# EasyEDA Pro project ProPrj_VFD-CLOCK_2024-10-19.epro, board PCB1
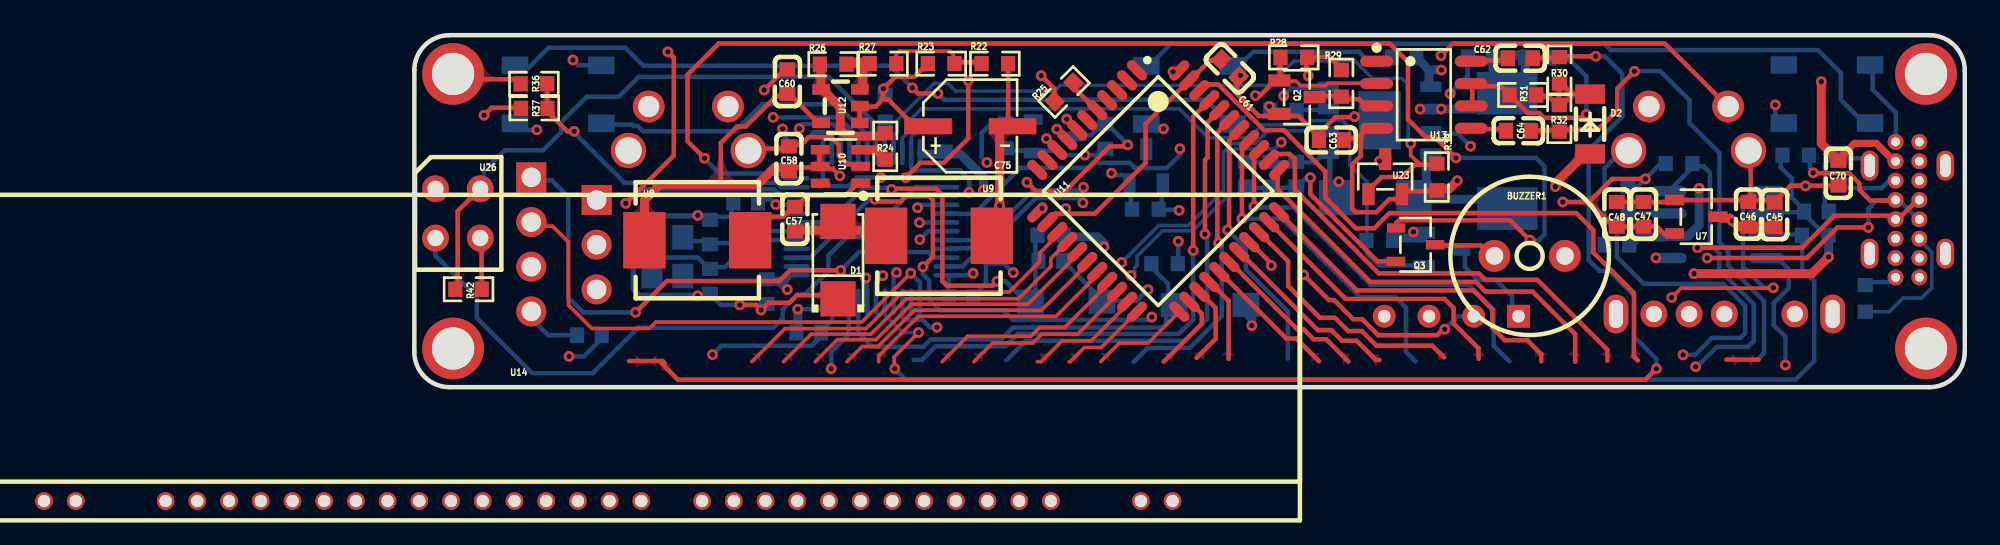
[diagram p6: board, top side]
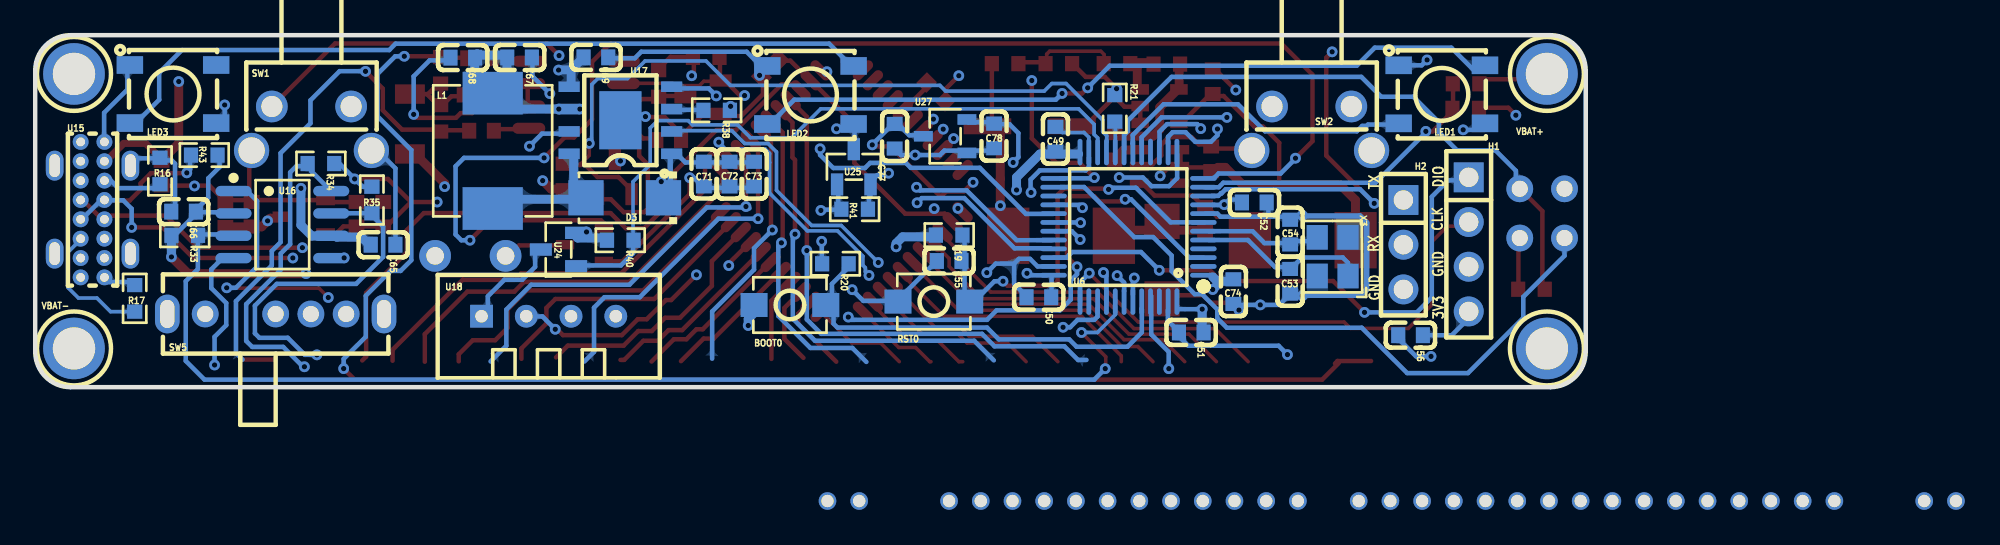
[diagram p7: board, bottom side, seen from below]

Outline 88 x 20 mm; copper layers: Top Layer, Inner1, Inner2, Bottom Layer. Coordinates in mm from the lower left corner of the outline.
Outline path: 0,18 0,2 arc(0.59,0.59) 2,0 86,0 arc(87.41,0.59) 88,2 88,18 arc(87.41,19.41) 86,20 2,20 arc(0.59,19.41) 0,18
Stack: Top Layer 0.035mm 外层铜厚1oz / Dielectric1 0.2104mm 7628 RC49% 8.6mil / Inner1 0.0152mm 内层铜厚 / Dielectric2 1.065mm 1.1mm H/HOZ 含铜 / Inner2 0.0152mm 内层铜厚 / Dielectric3 0.2104mm 7628 RC49% 8.6mil / Bottom Layer 0.035mm 外层铜厚1oz

## Design rules (mm)
template: 自定义配置
spacing copperThickness1oz (default): track to track 0.102, other pairs 0.152 to 0.3
spacing copperThickness2oz: track to track 0.203, other pairs 0.152 to 0.3
track width copperThickness1oz (default): min 0.127, default 0.254, max 2.54
track width copperThickness2oz: min 0.203, default 0.254, max 2.54
differential pair differentialPair (default): width min 0.127, default 0.254, max 2.54; gap min 0.152, default 0.152
via viaSize (default): diameter min 0.5, default 0.61, max 10; hole min 0.3, default 0.305, max 6.3

## Placement (name value [footprint] x y rotation side)
BOOT0  K2-1807SN-A3DW-06  [Key_SMD_3x4x2]  45.16 4.67 0 bottom
BUZZER1  HX-9042  [BUZ-TH_BD9.0-P4.00-D0.6-FD]  63.3 7.46 180 top
C45  100nF  [C0603]  77.21 9.8 270 top
C46  10uF  [C0603]  75.72 9.83 270 top
C47  22uF  [C0603]  69.76 9.83 270 top
C48  10uF  [C0603]  68.25 9.83 270 top
C49  100nF  [C0603]  30.1 14.09 270 bottom
C50  100nF  [C0603]  31.04 5.11 180 bottom
C51  100nF  [C0603]  22.38 3.11 180 bottom
C52  100nF  [C0603]  18.81 10.49 0 bottom
C53  20pF  [C0603]  16.78 6.02 270 bottom
C54  20pF  [C0603]  16.78 8.81 90 bottom
C55  100nF  [C0603]  36.13 7.17 180 bottom
C56  100nF  [C0603]  9.94 2.95 180 bottom
C57  1uF  [C0603]  21.6 9.55 90 top
C58  100nF  [C0603]  21.26 12.98 270 top
C60  100nF  [C0603]  21.17 17.36 270 top
C61  100nF  [C0603]  46.29 18.13 135 top
C62  10uF  [C0603]  62.78 18.69 0 top
C63  100nF  [C0603]  52.05 14.04 0 top
C64  10uF  [C0603]  62.67 14.57 0 top
C65  10uF  [C0603]  68.26 8.09 0 bottom
C66  100nF  [C0603]  79.58 9.97 0 bottom
C67  100nF  [C0603]  60.51 18.73 0 bottom
C68  22uF  [C0603]  63.73 18.72 180 bottom
C69  100nF  [C0603]  56.18 18.74 0 bottom
C70  22uF  [C0603]  80.83 12.16 90 top
C71  100nF  [C0603]  50.05 12.11 270 bottom
C72  22uF  [C0603]  48.59 12.11 270 bottom
C73  22uF  [C0603]  47.2 12.11 270 bottom
C74  100nF  [C0603]  20 5.43 270 bottom
C75  47uF  [C_Ele_SMD_5x5.4mm]  31.55 14.83 0 top
C77  10uF  [C0603]  39.22 14.26 90 bottom
C78  22uF  [C0603]  33.58 14.28 90 bottom
D1  SS34  [SMA_L4.3-W2.6-LS5.2-RD]  24.04 7.22 90 top
D2  ZMM5V1-M  [LL-34_L3.5-W1.5-RD]  66.73 14.95 270 top
D3  SS34  [SMA_L4.3-W2.6-LS5.2-RD]  54.54 10.76 0 bottom
H1  -  [HDR-TH_4P-P2.54-V-M]  6.64 8.11 270 bottom
H2  PZ254V-11-03P  [HDR-TH_3P-P2.54-V-M]  10.34 8.09 270 bottom
L1  10uH  [IND-SMD_L7.3-W6.6]  62.03 13.43 90 bottom
LED1  WS2812B-5050RGB  [LED-SMD_4P-L5.0-W5.0-BR_WS2812B-5050RGB]  8.16 16.64 0 bottom
LED2  WS2812B-5050RGB  [LED-SMD_4P-L5.0-W5.0-BR_WS2812B-5050RGB]  44 16.6 0 bottom
LED3  WS2812B-5050RGB  [LED-SMD_4P-L5.0-W5.0-BR_WS2812B-5050RGB]  80.18 16.66 0 bottom
Q2  SI2302  [SOT-23-3_L2.9-W1.3-P1.90-LS2.4-BR]  50.1 16.48 180 top
Q3  S8050 J3Y  [SOT-23-3_L3.0-W1.7-P0.95-LS2.9-BR]  56.83 8.09 180 top
R16  5.1kΩ  [R0603]  80.92 12.29 270 bottom
R17  5.1kΩ  [R0603]  82.35 5.05 270 bottom
R19  4.7kΩ  [R0603]  36.13 8.64 0 bottom
R20  4.7kΩ  [R0603]  42.59 7.01 180 bottom
R21  4.7kΩ  [R0603]  26.73 15.84 270 bottom
R22  75kΩ  [r0603]  32.95 18.38 0 top
R23  2kΩ  [r0603]  29.9 18.38 0 top
R24  100kΩ  [r0603]  26.73 13.68 270 top
R25  100kΩ  [r0603]  36.88 16.77 45 top
R26  100kΩ  [r0603]  23.77 18.36 0 top
R27  100kΩ  [r0603]  26.6 18.38 0 top
R28  10kΩ  [R0603]  49.92 18.74 0 top
R29  10kΩ  [R0603]  52.61 17.26 90 top
R30  3kΩ  [r0603]  64.99 18 90 top
R31  20kΩ  [r0603]  62.92 16.6 0 top
R32  3kΩ  [r0603]  64.99 15.28 90 top
R33  4.7kΩ  [R0603]  79.51 8.63 180 bottom
R34  4.7kΩ  [R0603]  71.78 12.71 180 bottom
R35  4.7kΩ  [R0603]  68.89 10.64 90 bottom
R36  2.7kΩ  [R0603]  6.79 17.24 180 top
R37  10kΩ  [R0603]  6.81 15.84 0 top
R38  1.1kΩ  [R0603]  49.32 15.73 0 bottom
R39  4.7kΩ  [R0603]  58.03 11.94 270 top
R40  4.7kΩ  [R0603]  54.79 8.35 0 bottom
R41  4.7kΩ  [R0603]  41.49 10.11 180 bottom
R42  100kΩ  [R0603]  3.08 5.56 0 top
R43  1.5kΩ  [R0603]  78.41 13.19 0 bottom
RST0  K2-1807SN-A3DW-06  [Key_SMD_3x4x2]  37 4.86 180 bottom
SW1  TS-1038-A10B3-D2  [KEY-TH_TS-1038-A10B3-D2]  72.32 14.7 0 bottom
SW2  TS-1038-A10B3-D2  [KEY-TH_TS-1038-A10B3-D2]  15.55 14.7 0 bottom
SW5  SK13D07VG4  [SW-TH_SK13D07VG4]  74.35 4.16 180 bottom
U6  -  [LQFP-48_L7.0-W7.0-P0.50-LS9.0-BL]  25.95 9.11 90 bottom
U7  ME6206A33XG  [SOT-23-3_L2.9-W1.6-P1.90-LS2.8-BR]  72.76 9.69 180 top
U8  10uH  [IND-SMD_L7.0-W6.6]  16.06 8.35 0 top
U9  10uH  [IND-SMD_L7.0-W6.6]  29.78 8.6 0 top
U10  MT3608  [SOT-23-6_L2.9-W1.6-P0.95-LS2.8-BL]  24.19 12.54 90 top
U11  PT6315-LQ  [LQFP-PT6315]  42.22 11.14 315 top
U12  LM321MF  [SOT-23-5_L2.9-W1.6-P0.95-LS2.8-BR]  24.19 15.97 0 top
U13  TC118S  [SOP-8_L4.9-W3.9-P1.27-LS6.0-BL]  57.3 16.62 270 top
U14  -  [7-BT-317NK]  5.14 0.35 0 top
U15  MC-118LD-H65  [USB-C-TH_HANBO_MC-118LD-H65]  84.75 10.09 90 bottom
U16  DS3231MZ/V+  [SOIC-8_L4.9-W3.9-P1.27-LS6.0-BL]  73.97 9.24 270 bottom
U17  TP5400  [ESOP-8_L4.9-W3.9-P1.27-LS6.0-BL-EP]  54.79 15.17 90 bottom
U18  DHT11  [SENSOR-TH_DHT11]  58.86 4.03 180 bottom
U21  M2*10+3六角单通铜  [CONN-TH_C9900012092]  2.2 2.2 180 bottom
U22  M2*10+3六角单通铜  [CONN-TH_C9900012092]  85.8 17.8 180 bottom
U23  AO3401  [SOT-23-3_L2.9-W1.3-P0.95-LS2.4-BR]  55.1 11.97 270 top
U24  AO3401  [SOT-23-3_L2.9-W1.3-P0.95-LS2.4-BR]  58.3 7.82 180 bottom
U25  AO3401  [SOT-23-3_L2.9-W1.3-P0.95-LS2.4-BR]  41.54 12.52 270 bottom
U26  ITR20001/T  [OPTO-TH_4P_ITR20001-T-F316]  2.47 9.87 90 top
U27  ME6206A33XG  [SOT-23-3_L2.9-W1.6-P1.90-LS2.8-BR]  36.35 14.26 180 bottom
VBAT+  M2*10+3六角单通铜  [CONN-TH_C9900012092]  2.2 17.8 180 bottom
VBAT-  M2*10+3六角单通铜  [CONN-TH_C9900012092]  85.8 2.2 180 bottom
X3  8MHz  [OSC-SMD_4P-L3.2-W2.5-BL]  14.36 7.41 90 bottom

## Footprints (pads in the part's own frame, mm; a bottom-side part is the same pattern mirrored in y, then rotated)
7-BT-317NK
  round 1 hole 0.7: 1(-26.154,-6.817) 2(-24.355,-6.817) 3(-19.255,-6.817) 4(-17.454,-6.817) 5(-15.655,-6.817) 6(-13.854,-6.817) 7(-12.055,-6.817) 8(-10.255,-6.817) 9(-8.454,-6.817) 10(-6.654,-6.817) 11(-4.854,-6.817) 12(-3.054,-6.817) 13(-1.254,-6.817) 14(0.545,-6.817) 15(2.345,-6.817) 16(4.146,-6.817) 17(5.946,-6.817) 18(7.745,-6.817) 19(11.195,-6.817) 20(12.995,-6.817) 21(14.796,-6.817) 22(16.596,-6.817) 23(18.395,-6.817) 24(20.195,-6.817) 25(21.995,-6.817) 26(23.796,-6.817) 27(25.596,-6.817) 28(27.395,-6.817) 29(29.195,-6.817) 30(30.995,-6.817) 31(36.096,-6.817) 32(37.895,-6.817)
BUZ-TH_BD9.0-P4.00-D0.6-FD
  round 1.8 hole 1: 1(-2,0) 2(2,0)
C0603
  rect 0.8x0.9 smd: 1(-0.7,0) 2(0.7,0)
C_Ele_SMD_5x5.4mm
  rect 2.7x0.91 smd: 1(-2.4,0) 2(2.4,0)
CONN-TH_C9900012092
  round 3.5 hole 2.4: 1(0,0)
ESOP-8_L4.9-W3.9-P1.27-LS6.0-BL-EP
  rect 0.6x1.2 smd: 1(-1.905,-2.909) 2(-0.635,-2.909) 3(0.635,-2.909) 4(1.905,-2.909) 5(1.905,2.909) 6(0.635,2.909) 7(-0.635,2.909) 8(-1.905,2.909)
  rect 3.3x2.4 smd: 9(0,0)
HDR-TH_3P-P2.54-V-M
  rect 1.7x1.7 hole 1.1: 1(-2.54,0)
  round 1.7 hole 1.1: 2(0,0) 3(2.54,0)
HDR-TH_4P-P2.54-V-M
  rect 1.7x1.7 hole 1.1: 1(-3.81,0)
  round 1.7 hole 1.1: 2(-1.27,0) 3(1.27,0) 4(3.81,0)
IND-SMD_L7.0-W6.6
  rect 2.4x3.2 smd: 1(-3,0) 2(3,0)
IND-SMD_L7.3-W6.6
  rect 2.424x3.42 smd: 1(3.278,0) 2(-3.278,0)
KEY-TH_TS-1038-A10B3-D2
  round 1.8 hole 1.2: 1(-2.25,-1.25) 2(2.25,-1.25)
  round 2 hole 1.5: 3(-3.4,1.25) 3(3.4,1.25)
Key_SMD_3x4x2
  rect 1.53x1.36 smd: 1(-2.035,0) 2(2.035,0)
LED-SMD_4P-L5.0-W5.0-BR_WS2812B-5050RGB
  rect 1.5x1 smd: 1(2.45,-1.65) 2(2.45,1.65) 3(-2.45,1.65) 4(-2.45,-1.65)
LL-34_L3.5-W1.5-RD
  rect 1.1x1.7 smd: 1(-1.7,0) 2(1.7,0)
LQFP-48_L7.0-W7.0-P0.50-LS9.0-BL
  oval 0.27x1.5 smd: 1(-2.75,-4.25) 2(-2.25,-4.25) 3(-1.75,-4.25) 4(-1.25,-4.25) 5(-0.75,-4.25) 6(-0.25,-4.25) 7(0.25,-4.25) 8(0.75,-4.25) 9(1.25,-4.25) 10(1.75,-4.25) 11(2.25,-4.25) 12(2.75,-4.25) 25(2.75,4.25) 26(2.25,4.25) 27(1.75,4.25) 28(1.25,4.25) 29(0.75,4.25) 30(0.25,4.25) 31(-0.25,4.25) 32(-0.75,4.25) 33(-1.25,4.25) 34(-1.75,4.25) 35(-2.25,4.25) 36(-2.75,4.25)
  oval 1.5x0.27 smd: 13(4.25,-2.75) 14(4.25,-2.25) 15(4.25,-1.75) 16(4.25,-1.25) 17(4.25,-0.75) 18(4.25,-0.25) 19(4.25,0.25) 20(4.25,0.75) 21(4.25,1.25) 22(4.25,1.75) 23(4.25,2.25) 24(4.25,2.75) 37(-4.25,2.75) 38(-4.25,2.25) 39(-4.25,1.75) 40(-4.25,1.25) 41(-4.25,0.75) 42(-4.25,0.25) 43(-4.25,-0.25) 44(-4.25,-0.75) 45(-4.25,-1.25) 46(-4.25,-1.75) 47(-4.25,-2.25) 48(-4.25,-2.75)
LQFP-PT6315
  oval 1.4x0.55 smd: 1(-5.7,4) 2(-5.7,3.2) 3(-5.7,2.4) 4(-5.7,1.6) 5(-5.7,0.8) 6(-5.7,0) 7(-5.7,-0.8) 8(-5.7,-1.6) 9(-5.7,-2.4) 10(-5.7,-3.2) 11(-5.7,-4) 23(5.7,-4) 24(5.7,-3.2) 25(5.7,-2.4) 26(5.7,-1.6) 27(5.7,-0.8) 28(5.7,0) 29(5.7,0.8) 30(5.7,1.6) 31(5.7,2.4) 32(5.7,3.2) 33(5.7,4)
  oval 0.55x1.4 smd: 12(-4,-5.7) 13(-3.2,-5.7) 14(-2.4,-5.7) 15(-1.6,-5.7) 16(-0.8,-5.7) 17(0,-5.7) 18(0.8,-5.7) 19(1.6,-5.7) 20(2.4,-5.7) 21(3.2,-5.7) 22(4,-5.7) 34(4,5.7) 35(3.2,5.7) 36(2.4,5.7) 37(1.6,5.7) 38(0.8,5.7) 39(0,5.7) 40(-0.8,5.7) 41(-1.6,5.7) 42(-2.4,5.7) 43(-3.2,5.7) 44(-4,5.7)
OPTO-TH_4P_ITR20001-T-F316
  round 1.524 hole 0.914: 1(-1.4,-1.27) 2(-1.4,1.27) 3(1.4,1.27) 4(1.4,-1.27)
OSC-SMD_4P-L3.2-W2.5-BL
  rect 1.4x1.2 smd: 1(-1.1,-0.875) 2(1.1,-0.875) 3(1.1,0.875) 4(-1.1,0.875)
r0603
  rect 0.806x0.864 smd: 1(-0.753,0) 2(0.753,0)
R0603
  rect 0.806x0.864 smd: 1(-0.753,0) 2(0.753,0)
SENSOR-TH_DHT11
  rect 1.296x1.296 hole 0.711: 1(-3.81,0)
  round 1.296 hole 0.711: 2(-1.27,0) 3(1.27,0) 4(3.81,0)
SMA_L4.3-W2.6-LS5.2-RD
  rect 2x2 smd: 1(-2.2,0) 2(2.2,0)
SOIC-8_L4.9-W3.9-P1.27-LS6.0-BL
  oval 0.588x2.045 smd: 1(-1.905,-2.772) 2(-0.635,-2.772) 3(0.635,-2.772) 4(1.905,-2.772) 5(1.905,2.772) 6(0.635,2.772) 7(-0.635,2.772) 8(-1.905,2.772)
SOP-8_L4.9-W3.9-P1.27-LS6.0-BL
  oval 0.63x1.865 smd: 1(-1.905,-2.683) 2(-0.635,-2.683) 3(0.635,-2.683) 4(1.905,-2.683) 5(1.905,2.683) 6(0.635,2.683) 7(-0.635,2.683) 8(-1.905,2.683)
SOT-23-3_L2.9-W1.3-P0.95-LS2.4-BR
  rect 1.25x0.7 smd: 1(1,-0.95) 2(1,0.95) 3(-1,0)
SOT-23-3_L2.9-W1.3-P1.90-LS2.4-BR
  rect 1.25x0.7 smd: 1(1,-0.95) 2(1,0.95) 3(-1,0)
SOT-23-3_L2.9-W1.6-P1.90-LS2.8-BR
  rect 1.07x0.6 smd: 1(1.235,-0.95) 2(1.235,0.95) 3(-1.235,0)
SOT-23-3_L3.0-W1.7-P0.95-LS2.9-BR
  rect 1.038x0.532 smd: 1(1.101,-0.95) 2(1.101,0.95) 3(-1.101,0)
SOT-23-5_L2.9-W1.6-P0.95-LS2.8-BR
  rect 1x0.6 smd: 1(1.1,-0.95) 2(1.1,0) 3(1.1,0.95) 4(-1.1,0.95) 5(-1.1,-0.95)
SOT-23-6_L2.9-W1.6-P0.95-LS2.8-BL
  rect 0.532x1.072 smd: 1(-0.95,-1.149) 2(0,-1.149) 3(0.95,-1.149) 4(0.95,1.149) 5(0,1.149) 6(-0.95,1.149)
SW-TH_SK13D07VG4
  round 1.524 hole 0.914: 1(-4,0) 3(0,0) 4(2,0) 5(4,0)
  oval 1.4x2.2 hole 0.8x1.6: 6(6.15,0) 7(-6.15,0)
USB-C-TH_HANBO_MC-118LD-H65
  oval 1.7x1 hole 1.3x0.6: 13(-2.5,-2.15) 13(-2.5,2.15) 13(2.5,-2.15) 13(2.5,2.15)
  round 0.9 hole 0.5: A1(-3.85,0.675) A4(-2.75,0.675) A5(-1.65,0.675) A6(-0.55,0.675) A7(0.55,0.675) A8(1.65,0.675) A9(2.75,0.675) A12(3.85,0.675) B1(3.85,-0.675) B4(2.75,-0.675) B5(1.65,-0.675) B6(0.55,-0.675) B7(-0.55,-0.675) B8(-1.65,-0.675) B9(-2.75,-0.675) B12(-3.85,-0.675)

## Nets
As in the schematic.

Pads without a net: LED3 4; U6 2 4 16 27 38 46; U10 6; U11 1 2 3 4 6 10 11; U13 1; U15 A8 B8; U18 3; U21 1

## Via types
v1: diameter 0.61, hole 0.305, Top Layer to Bottom Layer, 127 vias

## Routing (per net, layer and track width the routed paths; a pad name or vN(x,y) marks a point on that pad's centre or on a via; arc(x,y) is an arc through that point)
3V3: length 138
  Top Layer w0.254: v1(65.19,10.52) 66.67,10.52 ; 66.67,10.52 68.11,9.09 ; 66.67,10.52 67.98,11.83 v1(69.87,11.83) ; 68.23,9.17 68.27,9.13 70.51,9.13 70.96,8.69 71.44,8.69
  Top Layer w0.508: v1(80.27,7.4) 79.32,6.45 v1(72.63,6.45)
  Inner2 w0.508: 32.56,9.18 33.8,7.94 39.1,7.94 v1(39.14,7.97) 39.2,7.92 40.75,7.92 45.16,3.5 v1(47.53,3.5) 47.54,3.51 51.06,3.51 53.17,5.62 57.4,5.62 61.41,9.63 65.2,9.63 ; 32.56,9.18 32.54,9.18 31.44,8.08 31.44,7.75 ; 32.56,9.18 32.3,9.43 v1(32.3,11.2) ; 65.2,9.63 65.2,7.61 ; 65.2,9.63 65.2,10.5 v1(65.19,10.52) ; 22.39,5.06 21.91,5.55 v1(21.17,5.55) 20.6,6.12 15.43,6.12 12.25,2.94 7.96,2.94 6.67,4.23 ; 22.39,5.06 v1(21.77,4.43) ; 22.39,5.06 23.18,5.85 23.18,7.75 ; 23.18,7.75 22.03,7.75 20.51,9.26 v1(20.51,10.37) ; 23.18,7.75 23.36,7.57 31.26,7.57 31.44,7.75 ; v1(72.63,6.45) 66.03,6.45 65.21,7.27 ; v1(31.71,6.47) 31.71,7.47 31.44,7.75
  Bottom Layer w0.254: 6.62,3.93 7.6,2.95 9.17,2.95 ; 78.98,9.74 80.13,8.59 80.29,8.59 ; 78.82,10.17 78.78,10.17 78.18,10.77 78.18,11.86 77.54,12.5 77.54,13.18 ; 21.2,10.35 20.54,10.35 v1(20.51,10.37) 20.22,10.66 19.64,10.66 ; 30.61,6.36 31.6,6.36 v1(31.71,6.47) ; 78.81,9.94 76.88,9.94 76.83,9.89 ; 68.9,11.39 69.42,11.39 70.78,12.75 ; 23.18,4.38 23.12,4.43 v1(21.77,4.43) ; 30.32,6.34 30.32,5.13
  Bottom Layer w0.508: v1(32.3,11.2) 32.3,11.92 30.98,13.25 28.78,13.25 ; v1(39.14,7.97) 39.14,8.17 38.77,8.54 36.92,8.54 ; 20.12,6.01 20.7,6.01 ; 20.7,6.01 v1(21.17,5.55) ; 20.7,6.01 20.91,6.01 21.16,6.26 ; 21.66,3.26 21.77,3.36 v1(21.77,4.43) ; 47.01,4.4 47.53,3.88 v1(47.53,3.5) ; v1(80.27,7.4) 80.27,8.52
5V: length 113.4
  Top Layer w0.254: 52.72,14.14 53.5,14.14 54.03,14.66 ; 3.73,8.34 3.82,8.25 3.82,5.75 ; 56.05,10.67 55.33,10.67 54.6,9.94 53.43,9.94 53.23,10.15 53.23,12.65 53.72,13.14 53.72,14.31 54.03,14.66 ; 54.03,14.66 54.1,14.73 ; 56.33,11.14 58.16,11.14
  Top Layer w0.508: v1(59.2,11.73) 58.72,11.25 58.16,11.25 ; 74.17,9.6 74.66,9.6 v1(74.81,9.45) 75.15,9.11 77.2,9.11
  Inner2 w0.508: 72.22,4.2 74.18,4.2 ; 3.88,8.82 5.17,10.11 5.17,13.03 5.62,13.48 9.97,13.48 11.84,11.61 19.31,11.61 19.81,12.11 23,12.11 24.8,13.92 34.49,13.92 36.26,12.15 48.23,12.15 51.07,9.31 56.22,9.31 v1(56.71,8.82) 56.71,9.25 v1(59.2,11.73) 60.89,13.43 65.4,13.43 69.5,9.33 74.69,9.33 v1(74.81,9.45) 74.81,4.71 74.24,4.14
  Bottom Layer w0.254: 39.58,12.05 40.19,12.05 40.6,11.64 ; 40.61,11.73 40.61,10.86 40.68,10.8 40.68,10.14
  Bottom Layer w0.508: 55.7,8.48 57.21,8.48 57.49,8.76 ; v1(56.71,8.82) 56.64,8.75 56.64,8.6
  vias: v1(39.56,12.16)
GND: length 165.7
  Top Layer w0.254: 77.37,10.71 78.11,11.45 80.94,11.45 ; 18.47,4.64 v1(18.47,4.68) 19.38,4.68 v1(19.68,4.38) 20.09,4.8 21.28,4.8 21.71,5.22 23.78,5.22 ; 25.24,14.98 25.28,15.02 25.28,15.94 26.18,15.94 26.59,16.35 26.59,16.93 v1(26.62,16.96) 27.29,17.63 28.38,17.63 29,18.25 ; 62.03,16.72 61.65,17.1 60.47,17.1 ; 60.08,15.94 60.05,15.97 60.05,17.36 ; 71.35,10.63 77.08,10.63 77.21,10.5 ; 55.65,7.15 54.67,7.15 50.86,10.97 v1(50.86,11.9) ; 51.16,14.01 51.16,14.44 50.19,15.41 49.26,15.41 49.21,15.46 ; 28.34,14.9 26.9,16.34 26.64,16.34 ; v1(66.52,15.5) 66.32,15.3 64.12,15.3 63.85,15.57 63.2,15.57 62.43,16.34 ; 19.57,13.56 21.12,13.56 ; 5.96,15.88 4.39,15.88 v1(3.96,15.45) ; 48.75,15.41 47.94,15.41 46.7,16.65 46.7,17.3 ; v1(59.95,13.69) 59.84,13.69 59.8,13.73 ; v1(8.78,1.75) 8.78,1.76 ; 68.21,10.52 71.47,10.52 71.56,10.62 ; 21.15,18.02 20.99,18.02 v1(19.86,16.89) ; 75.82,13.07 75.85,13.04 75.85,10.65 ; 24.98,12.66 24.98,12.67 24.58,12.67 24.09,13.16 24.09,13.78 23.66,14.21 22.37,14.21 21.96,13.79 21.26,13.79 ; v1(35.58,17.7) 36.32,16.96 36.32,16.39 ; 51.32,13.91 51.32,14.39 52.28,15.35 53.34,15.35 v1(53.36,15.37)
  Bottom Layer w0.203: 28.2,13.86 28.2,14.2 28.47,14.47 29.71,14.47 29.88,14.64
  Bottom Layer w0.254: 68.36,13.23 67.55,12.43 67.55,8.31 ; v1(16.93,1.85) 17.43,2.35 22.56,2.35 23.18,2.97 ; 16.83,5.23 17.39,4.68 v1(18.47,4.68) 19.88,4.68 ; v1(38.06,13.19) 36.65,13.19 36.51,13.33 ; 80.83,13.01 82.33,13.01 82.68,12.66 ; 32.44,7.02 32.17,7.29 31.54,7.29 31.11,6.86 30.18,6.86 ; 32.44,7.02 33.48,7.02 v1(33.99,6.51) ; 32.44,7.02 32.44,5.88 31.99,5.42 ; 18.01,10.54 18.01,9.78 18.11,9.69 ; 80.06,10.3 80.06,12.7 80.25,12.89 80.98,12.89 ; 39.17,13.51 38.85,13.19 38.08,13.19 ; 36.51,13.33 36.41,13.44 33.59,13.44 ; v1(9,18.59) 9.31,18.29 10.72,18.29 ; v1(53.36,15.37) 53.48,15.49 54.51,15.49 ; 82.3,5.97 83.79,5.97 83.98,6.17 ; 38.58,5.17 38.58,5.42 36.87,7.13 ; v1(50.86,11.9) 50.62,11.9 50.21,11.5 ; 47.11,11.32 49.94,11.32 50.15,11.54 ; 16.95,9.68 20.73,9.68 20.91,9.87 21.59,9.87 ; 23.29,3.36 23.71,3.78 23.71,4.36 ; v1(41.63,5.54) 41,4.9 39.09,4.9 ; v1(8.78,1.75) 9.63,1.75 10.69,2.81 ; 31.49,11.1 31.5,11.11 31.5,11.8 30.98,12.32 28.38,12.32 28.19,12.5 28.19,13.05 ; 46.88,18.32 47.62,19.06 53.6,19.06 53.97,18.69 55.48,18.69 ; v1(66.52,15.5) 66.52,17.66 65.61,18.57 64.46,18.57 ; v1(59.95,13.69) 59.24,14.41 57.81,14.41 ; 82.77,18.13 82.77,16.91 84.09,15.59 84.09,14.01 ; 43.36,8.26 43.36,6.94 ; v1(58.79,16.68) 59.78,17.67 59.78,18.62
  Bottom Layer w0.305: 16.65,9.73 12.81,9.73 12.43,9.35 12.43,5.55 12.76,5.22 16.51,5.22 16.55,5.26
  vias: v1(16.08,9.76) v1(16.08,5.19) v1(31.48,11.06) v1(35.63,10.16) v1(43.07,17.93) v1(43.36,8.29) v1(46.89,17.72) v1(48.53,15.96) v1(70.47,7.35) v1(78.96,11.43)
VBAT: length 70.1
  Top Layer w0.254: 6.03,17.31 5.85,17.5 3.23,17.5
  Inner2 w0.8: 58.18,15.8 57.15,15.8 54.01,18.95 17.36,18.95 15.94,17.53 3.57,17.53 3.39,17.71 ; 1.9,17.84 2.7,18.64
  Bottom Layer w0.305: 57.61,15.8 58.28,15.8
  Bottom Layer w0.508: 61.23,17.36 61.23,18.86 62.84,18.86 62.92,18.94 63.06,18.8 63.06,17.61 ; v1(57.09,15.8) U17.6 v1(58.28,15.8) 60.9,15.8 61.03,15.93
VBAT_LOW: length 21.8
  Inner2 w0.508: 85.76,17.43 83.14,17.43 77.28,11.57 73.19,11.57 v1(72.92,11.3)
  Bottom Layer w0.508: v1(72.92,11.3) 72.92,9.21 72.3,8.59 70.95,8.59 70.88,8.52 69.47,8.52 69.03,8.08
VBUS: length 65.1
  Top Layer w0.4: 80.79,12.91 81.73,13.85 82.98,13.85 83.91,12.91
  Top Layer w0.503: v1(79.85,17.37) 79.85,13.85 80.79,12.91
  Inner2 w0.305: 83.96,12.87 83.01,13.82 82.17,13.82 81.68,13.33 81.68,6.65 82.06,6.27 82.99,6.27 83.87,7.15
  Inner2 w0.503: v1(79.85,17.37) 78.46,18.77 68.44,18.77 67.69,18.02 v1(58.3,18.02)
  Inner2 w0.508: 85.42,12.87 85.38,12.83 84.06,12.83 ; 85.51,7.3 85.42,7.38 84.09,7.38 ; 82.99,6.27 82.99,3.56 82.09,2.65 71.59,2.65 70.4,3.84
  Bottom Layer w0.503: 56.84,18.77 57.59,18.03 ; 57.59,18.03 57.59,17.12 ; 57.59,18.03 58.28,18.03 v1(58.3,18.02)
32K: length 73
  Top Layer w0.203: v1(77.13,5.65) 77.11,5.63 71.9,5.63 v1(71.37,5.09)
  Top Layer w0.254: v1(26.14,10.68) 26.26,10.56 27.6,10.56 27.89,10.85 29.21,10.85 29.44,10.63 29.44,7.41 v1(28.87,6.84)
  Inner2 w0.203: v1(41.85,3.98) 43.02,2.81 55.45,2.81 56.33,3.69 56.33,4.48 56.81,4.96 66.5,4.96 66.51,4.95 67.13,5.57 70.89,5.57 v1(71.37,5.09)
  Bottom Layer w0.254: 75.87,11.04 75.41,10.58 75.41,6.84 76.61,5.65 v1(77.13,5.65) ; 21.68,7.36 22.48,7.36 25.81,10.68 v1(26.14,10.68) ; v1(28.87,6.84) 28.87,6.42 29.23,6.06 29.23,4.98 29.84,4.36 33.44,4.36 33.98,3.83 41.69,3.83 v1(41.85,3.98)
B1: length 81.9
  Top Layer w0.254: v1(58.27,18.84) 58.96,19.53 70.98,19.53 74.46,16.04 ; 12,10.44 14.72,13.16 14.72,18.72 v1(14.39,19.06)
  Inner2 w0.254: v1(14.39,19.06) 14.91,19.57 55.24,19.57 55.97,18.84 v1(58.27,18.84)
  Bottom Layer w0.254: v1(12,10.44) 12.81,11.25 20.43,11.25 20.67,11.01 20.69,11.03 20.85,10.87 21.24,10.87
B2: length 24.4
  Top Layer w0.254: v1(31.44,17.42) 31.44,14.14 30.05,12.75 28.73,12.75 v1(27.89,11.91)
  Inner2 w0.254: 31.39,17.32 31.39,17.48 31.07,17.8 19.72,17.8 17.78,15.86
  Bottom Layer w0.254: v1(27.89,11.91) 27.93,11.87 29.84,11.87
BAT-5V: length 41.4
  Inner2 w0.508: v1(52.47,11.68) 56.64,11.68 59.5,14.54 65.52,14.54 69.77,10.3 76.08,10.3 78.29,8.09 78.29,4.1
  Bottom Layer w0.254: 47.3,12.77 51.1,12.77 51.47,13.14
  Bottom Layer w0.305: 51.96,13.14 51.96,10.83 51.77,10.64
  Bottom Layer w0.508: v1(52.47,11.68) 52.47,11.33 52.79,11.01
BAT_CHRG: length 32.1
  Inner2 w0.254: v1(27.37,6.51) 27.37,6.26 28.48,5.15 36.96,5.15 38.89,7.08 v1(40.15,7.08)
  Bottom Layer w0.203: 51.88,14.58 48.46,14.58 47.73,13.84 46.41,13.84 45.93,13.37 45.93,11.19 43.93,9.19 42.25,9.19 v1(40.15,7.08)
  Bottom Layer w0.254: v1(27.37,6.51) 27.2,6.35 27.2,4.88
BAT_FULL: length 33.8
  Inner2 w0.254: 49.37,16.53 49.96,15.94 49.96,14.68 v1(49.2,13.92) ; v1(40.68,6.35) 37.73,3.4 v1(29.66,3.4)
  Bottom Layer w0.203: 46.32,12.76 46.32,13.29 46.57,13.54 48.83,13.54 49.19,13.9 ; 46.32,12.76 46.32,11.03 44.18,8.88 42.46,8.88 41.02,7.44 41.02,6.92 40.88,6.79 40.88,6.56 v1(40.68,6.35) ; 46.32,12.76 46.34,12.77
  Bottom Layer w0.254: v1(49.34,16.55) 49.77,16.98 51.5,16.98 ; v1(29.66,3.4) 29.26,3.4 28.84,3.82 27.9,3.82 27.71,4.01 27.71,4.48
BAT_VOL_DET: length 17.3
  Top Layer w0.254: 7.53,17.27 7.53,15.93 7.52,15.93 ; v1(9.07,14.54) 8.68,14.54 7.51,15.71
  Bottom Layer w0.254: 21.63,11.36 20.82,11.36 20.57,11.62 11.93,11.62 9.07,14.47 v1(9.07,14.54)
BOOT0: length 23.1
  Bottom Layer w0.254: 25.21,4.46 25.19,4.43 25.19,3.11 26.01,2.3 28.89,2.3 29.31,2.72 33.31,2.72 33.98,3.39 42.46,3.39 42.69,3.61 42.69,4.52 ; 41.9,6.75 42.78,5.87 42.78,4.63
BOOT1: length 1.4
  Bottom Layer w0.203: 26.69,15.09 26.7,15.08 26.7,13.69
BUZZER: length 77.6
  Top Layer w0.254: v1(59.12,13.03) 57.96,14.19 57.42,14.19 56.4,15.21 56.4,18.49 55.35,19.53 17.28,19.53 15.51,17.76 15.51,13.98 v1(16.47,13.01) ; v1(63.32,8.35) 62.19,9.49 55.89,9.49 55.74,9.33 55.74,9.15
  Bottom Layer w0.254: v1(16.47,13.01) 16.47,12.98 17.31,12.14 20.83,12.14 21.09,11.89 ; v1(59.12,13.03) 63.66,13.03 64.14,12.55 64.14,8.68 63.81,8.35 v1(63.32,8.35)
CLK: length 18.7
  Top Layer w0.254: v1(36.47,14.66) 36.8,14.32 36.87,14.32
  Inner2 w0.254: v1(21.85,14.69) 22.21,15.06 36.07,15.06 v1(36.47,14.66)
  Bottom Layer w0.254: 24.19,13.73 24.19,14.52 23.76,14.95 22.05,14.95 21.96,14.86
DHT11: length 38.7
  Top Layer w0.254: 58.62,3.31 58.4,3.31 58.05,2.96 54.71,2.96 53.8,3.86 53.29,3.86 52.2,4.95 51.9,4.95 v1(50.47,6.38)
  Inner2 w0.203: v1(50.47,6.38) 49.3,7.56 48.07,7.56 47.36,6.85 43.72,6.85 41.37,9.2 35.12,9.2 32.56,11.76 31.22,11.76 29.66,10.2 v1(28.56,10.2)
  Bottom Layer w0.254: v1(58.48,3.29) 59.21,4.02 60.07,4.02 ; v1(28.56,10.2) 28.72,10.36 30.18,10.36
DHT11_POWER: length 39.2
  Bottom Layer w0.203: 54.07,8.46 54.07,11.67 53.09,12.65 53.09,14.72 52.67,15.14 50.94,15.14 50.7,14.91 48.13,14.91 47.4,14.17 45.06,14.17 43.41,15.82 28.78,15.82 27.9,14.94 27.9,14.36 27.69,14.16 27.69,13.88
  Bottom Layer w0.254: 54.07,8.22 54.07,7.6 54.75,6.92 57.79,6.92
DIN: length 23.4
  Top Layer w0.254: v1(37.02,15.23) 37.51,14.74 37.54,14.74
  Inner2 w0.254: v1(20.36,15.33) 20.67,15.64 36.62,15.64 v1(37.02,15.23)
  Bottom Layer w0.254: v1(20.36,15.33) 24.07,15.33 25.2,14.2 25.2,13.78
DS_IRQ: length 67.7
  Top Layer w0.203: 27.24,1.01 27.24,1.73 v1(28.62,3.11)
  Bottom Layer w0.203: 26.69,4.57 26.69,4.13 27.71,3.11 28.38,3.11 28.39,3.11 v1(28.62,3.11)
  Bottom Layer w0.254: 76.81,8.68 78.64,8.68 78.69,8.73 ; v1(27.27,1.05) 27.89,0.43 78.39,0.43 79.46,1.49 79.46,6.02 78.77,6.71 78.77,8.48 78.65,8.59
DS_RST: length 66.4
  Inner2 w0.254: v1(23.66,1.05) 24.28,0.44 77,0.44 v1(77.82,1.26)
  Bottom Layer w0.254: v1(77.82,1.26) 77.82,2.86 77.16,3.52 77.16,4.78 78.01,5.63 78.01,6.69 77.34,7.36 ; 23.67,0.98 23.67,2.01 24.66,3 24.66,5.19
F1: length 84.3
  Top Layer w0.254: 12.18,1.49 14.08,1.49 14.23,1.34 ; 14.01,1.37 14.96,0.43 69.87,0.43 v1(70.49,1.05) ; 65.09,18.8 65.03,18.8 64.96,18.72 ; 65.09,18.8 65.01,18.72 63.54,18.72 ; 65.09,18.8 v1(67.05,18.8)
  Bottom Layer w0.254: v1(67.05,18.8) 67.57,18.8 68.56,17.81 68.56,15.39 66.65,13.47 66.65,7.22 67.27,6.61 67.83,6.61 69.24,5.19 69.24,2.86 70.49,1.61 v1(70.49,1.05)
F2: length 30.1
  Top Layer w0.254: 63.34,14.6 64.87,14.6 64.89,14.57 ; 76.3,1.57 74.47,1.57 ; v1(69.25,17.95) 68.27,16.96 68.27,15.73 67.18,14.64 65.11,14.64
  Bottom Layer w0.254: 76.23,1.57 76.61,1.94 76.61,4.89 74.57,6.92 74.57,7.74 74.07,8.24 74.07,13.3 72.38,15 72.38,16.3 70.72,17.96 69.26,17.96 v1(69.25,17.95)
G1: length 35.4
  Top Layer w0.254: 52.53,9.94 53.44,9.03 54.48,9.03 55.34,9.89 65.95,9.89 ; 52.53,9.94 52.54,9.94 ; 52.53,9.94 51.71,10.77 51.71,12.24 49.34,14.61 48.23,14.61 45.63,17.21 44.97,17.21 ; 69.44,1.52 69.22,1.74 69.22,5.36 66.92,7.66 66.92,8.92 65.95,9.89
G2: length 29.5
  Top Layer w0.254: 45.02,16.18 44.21,15.36 v1(44.21,7.76)
  Bottom Layer w0.254: v1(44.21,7.76) 44.21,3.85 43.39,3.03 34.26,3.03 33.55,2.32 29.59,2.32 28.81,1.55 28.34,1.55
G3: length 24.4
  Top Layer w0.254: v1(44.88,8.69) 44.88,12.91 45.02,13.06 45.02,15.04 45.55,15.57
  Bottom Layer w0.254: 33.59,1.53 34.71,2.64 43.74,2.64 45,3.89 45,8.57 v1(44.88,8.69)
G4: length 17.5
  Top Layer w0.254: 46.19,15.08 45.58,14.47 45.58,8.28 v1(45.65,8.2)
  Bottom Layer w0.254: v1(45.65,8.2) 45.82,8.03 45.82,4.05 44,2.23 41.62,2.23 40.83,1.44
G5: length 14.3
  Top Layer w0.254: v1(46.16,8.93) 46.24,9.01 46.24,14 46.6,14.36
  Bottom Layer w0.254: 49.58,1.62 49.58,4.3 47.2,6.68 47.2,7.89 v1(46.16,8.93)
G6: length 19.1
  Top Layer w0.254: 47.23,13.85 46.97,13.6 v1(46.97,9.57)
  Bottom Layer w0.254: v1(46.97,9.57) 49.22,9.57 53.68,5.11 55.69,5.11 56.28,4.52 56.28,2 56.82,1.46
G7: length 22.8
  Top Layer w0.254: v1(47.66,10.26) 47.66,13.16 47.91,13.41
  Bottom Layer w0.254: 47.46,10.16 47.52,10.21 49.88,10.21 54.28,5.82 59.85,5.82 61.26,4.41 61.26,2.36 62.15,1.46
ITR_RX: length 34.3
  Top Layer w0.254: 2.44,5.6 2.46,5.62 2.46,10 3.65,11.2
  Bottom Layer w0.254: 3.96,11.45 3.96,12.3 5.12,13.46 7.3,13.46 8.33,14.49 8.33,15.05 9.78,16.5 11.6,16.5 12.73,17.63 23.5,17.63 25.98,15.15 25.98,14.55 26.19,14.34 26.19,13.52
ITR_TX: length 38.1
  Bottom Layer w0.254: 1.2,8.32 1.2,7.47 3.54,5.13 3.54,3.94 6.68,0.8 10.13,0.8 12.71,3.37 20.37,3.37 20.91,3.92 20.91,4.42 21.77,5.28 22.19,5.28 23.5,6.6 23.5,7.48 24.55,8.53 25.62,8.53 28.47,11.37 29.79,11.37
OSC_IN: length 9
  Bottom Layer w0.254: 16.74,6.82 17.63,6.82 19.17,8.36 21.39,8.36 ; 13.5,6.59 13.5,7.07 13.79,7.37 16.09,7.37 16.47,6.99
OSC_OUT: length 6.3
  Bottom Layer w0.254: 15.39,8.3 16.69,8.3 16.8,8.19 18.23,8.19 18.91,8.86 21.34,8.86
P1: length 20.8
  Top Layer w0.203: 19.16,1.45 21.04,3.33 25.64,3.33 27.71,5.4 33.76,5.4 35.49,7.13 35.49,7.62 36.49,8.62 U11.14
P2: length 19.2
  Top Layer w0.203: 20.96,1.45 22.52,3.01 25.92,3.01 27.93,5.03 34.3,5.03 36.13,6.86 36.13,7.31 U11.15
P3: length 17.5
  Top Layer w0.203: 22.76,1.45 24.01,2.7 26.19,2.7 28.21,4.72 34.82,4.72 37.63,7.52 U11.16
P4: length 16.1
  Top Layer w0.203: U11.17 38.19,6.97 35.59,4.37 28.38,4.37 26.32,2.31 25.42,2.31 24.56,1.45
P5: length 14.8
  Top Layer w0.203: 26.36,1.45 26.36,1.78 28.61,4.03 36.42,4.03 38.76,6.37 38.76,6.55
P6: length 11.3
  Top Layer w0.203: 39.32,5.98 39.32,5.8 36.92,3.4 35.49,3.4 34.98,2.89 31.4,2.89 29.96,1.45
P7: length 9.9
  Top Layer w0.203: 31.76,1.45 32.82,2.51 35.11,2.51 35.62,3.02 37.65,3.02 39.89,5.26 U11.20
P8: length 6.6
  Top Layer w0.203: 35.36,1.45 35.58,1.45 36.76,2.63 38.41,2.63 40.45,4.68 U11.21
P9: length 5
  Top Layer w0.203: 37.16,1.45 37.23,1.45 38.03,2.25 38.99,2.25 U11.22
P10: length 5.6
  Top Layer w0.203: U11.23 41.65,2.51 40.02,2.51 38.96,1.45
P11: length 4.4
  Top Layer w0.254: 42.54,1.45 44.7,3.61 44.7,4.17 44.27,4.6 44.07,4.6
P12: length 4.4
  Top Layer w0.254: 44.71,5.27 45.48,4.5 45.48,2.75 44.4,1.67
P13: length 4.5
  Top Layer w0.254: 45.4,5.72 46.22,4.91 46.22,1.6
P14: length 7.6
  Top Layer w0.254: 51.35,1.48 50.06,2.76 49.49,2.76 45.79,6.46
P15: length 9
  Top Layer w0.254: 46.36,7.04 50.11,3.29 50.47,3.29 51.04,2.72 51.75,2.72 53.02,1.46
P16: length 10.4
  Top Layer w0.254: 54.78,1.55 54.57,1.55 53.48,2.64 52.66,2.64 52.05,3.24 51.28,3.24 46.88,7.64
P17: length 14.2
  Top Layer w0.254: 58.44,1.69 57.77,2.36 54.6,2.36 53.77,3.19 53,3.19 52.25,3.94 51.41,3.94 49.59,5.75 49.59,7.16 47.99,8.76
P18: length 15.9
  Top Layer w0.254: 48.54,9.33 52.87,5.01 58.48,5.01 58.99,4.5 58.99,3.62 60.4,2.2 60.4,1.61
P19: length 19
  Top Layer w0.254: 49.25,9.74 53.5,5.5 60.11,5.5 61.19,4.41 61.19,3.37 61.89,2.67 63.16,2.67 63.96,1.87 63.96,1.47
P20: length 22.8
  Top Layer w0.254: 49,12.14 49,11.24 54.26,5.98 60.25,5.98 60.81,5.43 63.47,5.43 65.89,3.01 65.89,1.45
P21: length 25.5
  Top Layer w0.254: 67.72,1.5 67.72,2.12 63.74,6.1 60.79,6.1 60.42,6.47 54.74,6.47 49.98,11.22 49.98,12.94 49.67,13.25 48.84,13.25 48.59,13
REST: length 23.5
  Top Layer w0.254: v1(33.07,6.02) 32.82,5.77 30.23,5.77 29.97,6.02 29.97,10.92 29.61,11.28 27.12,11.28 v1(27.08,11.24)
  Bottom Layer w0.254: 21.65,9.37 23.56,9.37 25.52,11.33 26.99,11.33 v1(27.08,11.24) ; 34.69,4.89 33.55,6.02 v1(33.07,6.02) ; 35.25,4.64 35.25,8.32 35.38,8.46
SCL: length 71.7
  Inner2 w0.203: v1(72.72,1.16) 71.34,1.16 70.29,2.2 27.02,2.2 25,4.22 25,6.44 25.37,6.81 26.12,6.81 v1(26.59,6.34)
  Bottom Layer w0.254: 26.2,5.46 26.2,5.94 v1(26.59,6.34) ; v1(72.72,1.16) 72.8,1.16 73.92,2.29 75.69,2.29 76.03,2.63 76.03,4.71 74.07,6.67 74.07,7.59 73.53,8.12 73.53,12.2 73.18,12.55 72.63,12.55 ; 72.34,12.7 72.34,12.28 71.25,11.19
SDA: length 68.9
  Inner2 w0.203: 25.62,6.2 25.62,4.34 27.45,2.51 70.84,2.51 71.51,1.84 v1(72.01,1.84)
  Bottom Layer w0.254: 25.7,5.27 25.7,6.13 v1(25.62,6.21) ; 70.85,9.88 69.01,9.88 68.26,9.12 68.26,7.4 69.79,5.87 74.29,5.87 75.53,4.63 75.53,3.06 75.28,2.8 73.66,2.8 72.7,1.84 v1(72.01,1.84)
STB: length 20.2
  Top Layer w0.254: 36.22,13.81 36.19,13.81 v1(35.87,14.12)
  Inner2 w0.254: v1(20.9,14.67) 21.53,14.04 22.51,14.04 23.01,14.54 35.46,14.54 v1(35.87,14.12)
  Bottom Layer w0.254: 23.71,13.82 23.71,14.23 23.44,14.49 22.71,14.49 22.16,13.94 21.27,13.94 20.9,14.31 v1(20.9,14.67)
STM32_USB_DN: length 62.8
  Top Layer w0.254: 84.06,9.6 84.27,9.6 85.34,10.67 ; 84.14,9.75 80.59,9.75 78.77,7.93 v1(72.84,7.93)
  Inner2 w0.203: v1(72.84,7.93) 72.25,8.51 69.32,8.51 65.22,12.62 61.43,12.62 57.08,8.26 51.41,8.26 48.19,11.48 46.74,11.48 46.54,11.27 38.06,11.27 v1(37.98,11.36)
  Bottom Layer w0.254: v1(37.98,11.36) 37.8,11.18 35.13,11.18 32.3,8.35 30.27,8.35
STM32_USB_DP: length 70.9
  Top Layer w0.254: 84.04,10.6 82.64,10.6 82.02,11.22 82.02,11.57 81.44,12.16 79.41,12.16 v1(79.4,12.18) ; v1(82.53,9.08) 80.77,9.08 79.03,7.34 v1(73.38,7.34)
  Inner2 w0.203: v1(73.38,7.34) 72.63,7.34 71.82,8.15 68.99,8.15 65.02,12.12 61.73,12.12 57.38,7.77 51.25,7.77 47.94,11.08 47.03,11.08 46.82,10.88 38.35,10.88 v1(37.95,10.48)
  Bottom Layer w0.254: 85.4,9.49 84.24,10.66 84.06,10.62 ; v1(79.4,12.18) 79.21,12.37 79.21,13.16 ; v1(37.95,10.48) 37.68,10.74 35.27,10.74 32.42,7.89 30.37,7.89 ; v1(82.53,9.08) 82.53,10.14 83.01,10.62 84.06,10.62 ; 84.06,10.62 84.24,10.62
SWCLK: length 28.8
  Top Layer w0.203: v1(28.17,6.48) 25.4,3.7 13.71,3.7 13.35,3.34 10.07,3.34 8.75,4.66 8.75,8.25 7.85,9.15 7.03,9.15
  Bottom Layer w0.254: v1(28.17,6.48) 28.7,5.96 28.7,4.87
SWDIO: length 31.4
  Top Layer w0.254: v1(24.2,6.64) 21.32,6.64 20.71,6.03 14.33,6.03 v1(12.55,4.25)
  Bottom Layer w0.254: v1(12.55,4.25) 9.58,4.25 8.73,5.1 8.73,10.82 7.8,11.75 6.79,11.75 ; 30.21,7.36 29.47,7.36 29.15,7.68 25.24,7.68 v1(24.2,6.64)
UART1_RX: length 22.1
  Inner2 w0.254: v1(28.69,8.39) 23.62,8.39 20.92,11.1 20.27,11.1 19.66,10.49 13.16,10.49 11,8.33 10.53,8.33
  Bottom Layer w0.254: v1(28.69,8.39) 29.17,8.86 30.12,8.86
UART1_TX: length 20.4
  Inner2 w0.254: 10.77,10.88 10.95,11.06 19.61,11.06 20.12,11.58 21.38,11.58 23.61,9.35 v1(28.67,9.35)
  Bottom Layer w0.254: v1(28.67,9.35) 28.68,9.36 29.98,9.36
VFD-3V3: length 25.1
  Top Layer w0.254: 45.66,18.55 45.14,18.55 44.18,17.59 ; 43.86,17.31 41.51,14.96 41.51,12.74 38.62,9.86 36.38,9.86 35.88,9.36 ; 43.97,17.48 44.09,17.48
  Inner2 w0.254: 32.47,12.73 32.76,12.73 34.55,10.93 36.19,10.93 v1(36.98,10.14)
  Bottom Layer w0.254: 33.52,14.94 32.7,14.94 32.2,14.44 32.2,13.06 v1(32.5,12.77) ; 35.16,15.17 35.04,15.05 33.57,15.05
VFD-5V: length 68.6
  Top Layer w0.254: 50.8,18.77 51.94,18.77 52.53,18.18 ; 39.47,13.68 39.47,13.68 ; 39.47,13.68 36.67,10.88 36.53,10.88 36.29,11.12 35.29,11.12 v1(34.77,11.64) ; 39.47,13.68 40.41,13.68 v1(40.49,13.77) ; v1(24.15,12.01) 23.75,12.4 23.33,12.4 23.25,12.48 ; 21.18,12.49 23,12.49 ; 22.82,15.13 21.4,16.54 20.55,16.54 18.81,14.81 18.32,14.81 17.39,13.89 17.39,11.63 17.34,11.58 ; 23,15.01 23.01,15.02 ; v1(54.78,12.85) 55,13.06 55.29,13.06 55.34,13.01 ; 50.62,18.76 50.62,17.82 v1(50.74,17.7) ; 23,13.45 23,12.62
  Top Layer w0.508: 13.07,8.65 13.07,10.63 13.95,11.52 19.48,11.52 20.45,12.49 20.9,12.49
  Inner2 w0.254: v1(54.78,12.85) 52.22,15.41 52.22,16.59 51.12,17.7 v1(50.74,17.7) ; v1(40.49,13.77) 42.56,13.77 45.82,17.03 47.24,17.03 47.53,17.32 50.35,17.32 50.73,17.71 ; v1(34.77,11.64) 33,13.41 25.62,13.41 24.22,12.01 v1(24.15,12.01)
  Bottom Layer w0.254: 39.08,15.01 38.39,14.31 37.7,14.31 ; 39.4,14.88 40.49,13.78 40.49,13.74
VFD-PWM: length 28.9
  Top Layer w0.203: 54.4,17.21 54.35,17.27 51.86,17.27 51.72,17.14 50.3,17.14 50.05,17.38 49.14,17.38
  Top Layer w0.254: 49.14,17.38 49.14,18.78 49.15,18.79 ; 48.72,17.3 48,16.57 v1(47.74,16.57)
  Inner2 w0.254: v1(47.74,16.57) 46.48,16.57 v1(43.45,13.55)
  Bottom Layer w0.254: 42.71,12.45 43.45,13.2 v1(43.45,13.55) ; 42.68,12.45 40.91,12.45 40.62,12.74 38.59,12.74 38.31,12.46 34.39,12.46 31.77,9.84 30.22,9.84
VFD_POWER: length 41.7
  Top Layer w0.203: v1(56.55,13.85) 56.55,13.17 57.12,12.61
  Top Layer w0.254: 54.33,11.32 54.33,11.37 54.9,11.94 56.09,11.94 56.77,12.63 57.1,12.63 57.11,12.64 57.96,12.64
  Bottom Layer w0.203: v1(56.55,13.85) 56.41,13.99 56.41,17.19 56.07,17.54 54.38,17.54 53.38,18.54 49.93,18.54 48.54,17.15 36.66,17.15 36.33,16.82 30.73,16.82 30.3,17.25 29.49,17.25 27.41,15.18 27.41,14.51 27.18,14.28 27.18,13.94
VH: length 51.6
  Top Layer w0.254: 33.71,14.99 33.7,15 33.7,18.25 ; 47.57,8.1 48.64,7.03 v1(48.64,6.91)
  Top Layer w0.508: v1(64.76,11.39) 64.76,11.58 66.28,13.1 ; 33.22,11.84 33.24,11.82 ; 33.22,11.84 33.22,14.66 ; 33.22,11.84 v1(33.22,10.31) 33.22,9.08 33.25,9.05
  Inner2 w0.508: 47.69,5.93 47.69,5.35 48.8,4.24 50.49,4.24 52.57,6.33 56.85,6.33 61.91,11.39 v1(64.76,11.39) ; v1(48.64,6.91) 47.66,5.93 43.71,5.93 40.95,8.7 34.84,8.7 v1(33.22,10.31)
WS2812: length 17.2
  Bottom Layer w0.254: 10.54,14.92 12.35,14.92 12.43,14.84 12.68,14.84 12.99,14.54 18.2,14.54 19.74,16.08 23.96,16.08 25.71,14.33 25.71,13.85 25.72,13.84
WS2812-5V: length 82.1
  Inner2 w0.254: 42.54,14.68 42.54,15.73 45.11,18.3 53.01,18.3 56.18,15.13 61.99,15.13 64.18,17.32 75.97,17.32 v1(77.25,16.04) ; v1(6.95,14.62) 6.95,14.72 8,15.76 11.08,15.76 11.89,14.95 12.55,14.95 12.87,14.63 18.2,14.63 18.35,14.79 18.6,14.79 19.92,16.11 38.47,16.11 39.9,14.68 v1(42.52,14.68)
  Bottom Layer w0.254: 41.93,14.79 42.41,14.79 v1(42.52,14.68) ; v1(6.95,14.62) 5.76,14.62 5.47,14.91 ; 41.5,13.6 41.5,15.05 41.51,15.06 ; 77.36,15.01 77.25,15.12 v1(77.25,16.04)
WS2812_POWER: length 26.1
  Inner2 w0.203: v1(43.41,10.04) 42.9,9.54 35.31,9.54 32.78,12.07 28.52,12.07 28.12,12.47 27.66,12.47 27.31,12.12 26.68,12.12 v1(26.48,11.91)
  Bottom Layer w0.254: 42.42,11.31 42.42,10.32 42.19,10.08 ; 23.19,13.2 23.19,11.88 23.64,11.42 24.64,11.42 25.13,11.91 v1(26.48,11.91) ; 42.31,10.08 43.41,10.08 43.45,10.05
$1N1253: length 1.7
  Top Layer w0.254: 37.4,17.16 37.4,17.05 38.55,15.9
$1N1296: length 5.9
  Top Layer w0.254: 19.62,9.68 20.92,9.68 21.5,10.26 ; 25.16,11.58 24.47,10.89 22.31,10.89 21.85,10.43
$1N1297: length 4.8
  Top Layer w0.508: 21.56,8.92 26.27,8.92 26.3,8.89
$1N1299: length 1.2
  Top Layer w0.508: 26.63,13.07 26.23,13.48 25.63,13.48
$1N1300: length 2.8
  Top Layer w0.508: 24.46,18.44 25.71,18.44 ; 25.71,18.44 25.45,18.18 25.45,17.05 ; 25.71,18.44 25.76,18.4
$1N1301: length 6.8
  Top Layer w0.508: 26.64,14.32 26.59,14.26 24.56,14.26 24.18,14.65 24.18,15.9 23.07,17 23.07,18.32
$1N1303: length 5.9
  Top Layer w0.203: 30.58,18.59 30.59,18.6 30.59,18.92 30.42,19.09 27.52,19.09 27.33,18.9 27.33,18.33
  Top Layer w0.254: 32.21,18.46 30.84,18.46 30.7,18.33
$1N1312: length 5.2
  Top Layer w0.254: 63.74,16.53 64.38,16.53 64.68,16.23 ; 65.11,17.26 65.71,16.65 66.82,16.65 ; 65.75,16.63 65.22,16.11 64.96,16.11 64.96,17.33
$1N1318: length 1.6
  Top Layer w0.254: 60.5,18.57 61.94,18.57 62.04,18.66
$1N1319: length 1.8
  Top Layer w0.254: 60.26,14.66 61.95,14.66 62,14.61
$1N1408: length 3.3
  Top Layer w0.254: 52.67,16.52 52.64,16.55 50.91,16.55 ; 52.54,16.37 53.62,16.37 53.95,16.04
$2N2590: length 3.2
  Top Layer w0.254: 57.96,8.05 60.54,8.05 60.98,7.62
$2N4036: length 42.1
  Top Layer w0.254: v1(28.26,17.01) 28.59,16.69 v1(29.72,16.69)
  Bottom Layer w0.254: 6.39,18.05 7.62,19.29 11.97,19.29 13,18.26 27.01,18.26 v1(28.26,17.01) ; 46.24,15.01 44.92,16.34 30.07,16.34 v1(29.72,16.69)
$2N4043: length 44
  Bottom Layer w0.254: 41.87,18.45 42.94,19.52 67.55,19.52 67.91,19.16 79.67,19.16 80.97,17.86 80.97,16.33 82.54,14.75
$2N10742: length 5.1
  Bottom Layer w0.254: 62.31,4.41 62.31,5.16 61.37,6.1 60.36,6.1 59.63,6.83 59.63,7.79 59.64,7.81
$3N719: length 7.3
  Bottom Layer w0.203: 85.42,8.39 86.13,7.68 86.13,5.65 85.55,5.06 84.5,5.06 83.72,4.29 82.55,4.29 82.49,4.34
$3N723: length 3.4
  Bottom Layer w0.254: 80.98,11.47 81.13,11.31 83.28,11.31 83.75,11.78 84.1,11.78
$3N920: length 1.6
  Bottom Layer w0.254: 51.64,15.8 51.6,15.76 50.06,15.76
$3N1362: length 6.6
  Bottom Layer w0.508: 57.31,10.99 57.44,11.12 57.44,13.28 ; 61.54,10.63 61.5,10.68 57.32,10.68

## Copper pours and planes (outline as drawn; the poured copper is in the pictures)
GND on Bottom Layer: 12.54,9.64 14.16,9.64 14.16,7.78 12.54,7.78
GND on Bottom Layer: 14.62,7.03 15.82,7.03 15.82,5.15 14.62,5.15
GND on Inner1: -5.28,27.01 93.22,27.01 93.22,-7.25 -5.28,-7.25

Small or netless copper shapes (teardrops, artwork), in the pictures only: 280 on Top Layer, 301 on Bottom Layer, 97 on Inner2

## Text on the board
Bottom Silkscreen Layer: DIO | 3V3 | GND | CLK | TX | RX
